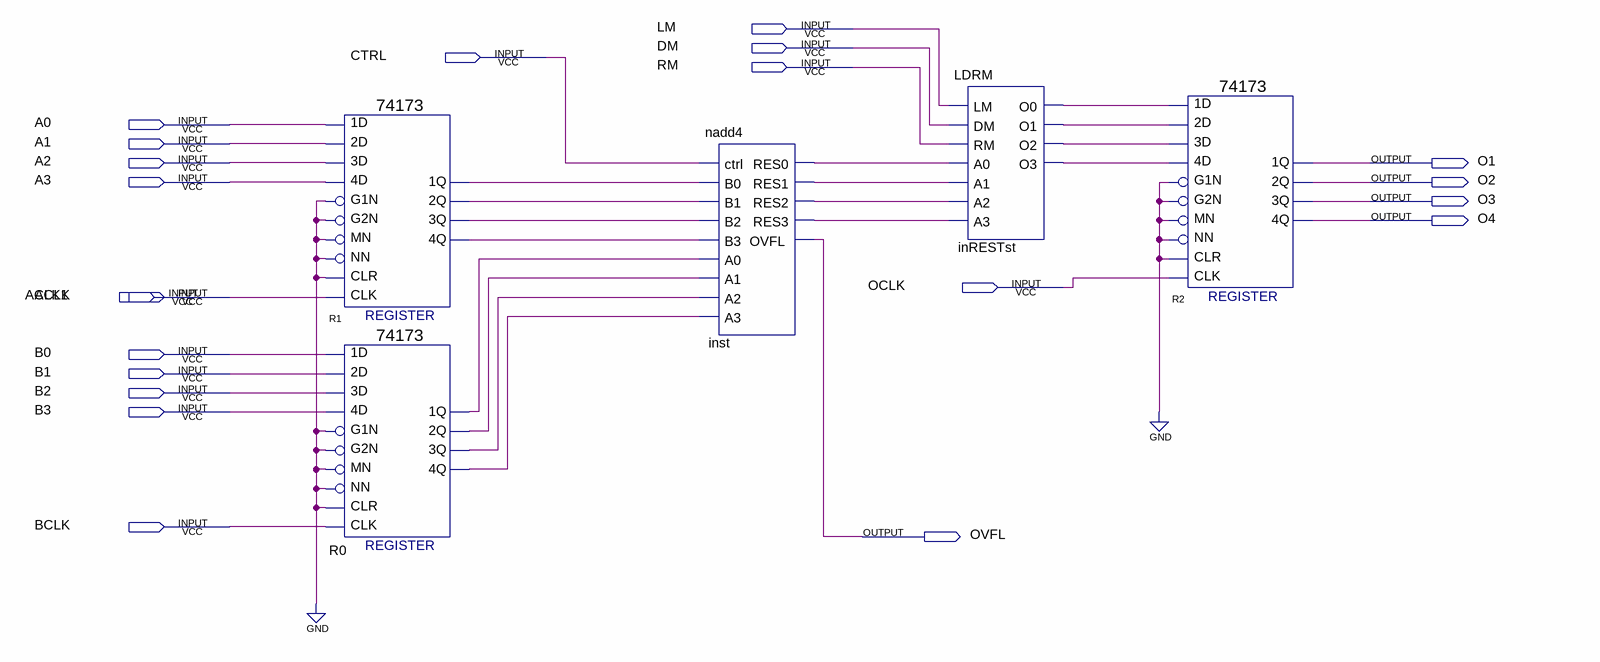
[diagram p0: schematic sheet]
// Quartus schematic exp5.bdf as structural Verilog: 5 symbols, 21 pins
module exp5 (
  input  LM,
  input  DM,
  input  CTRL,
  input  RM,
  input  A0,
  input  A1,
  input  A2,
  input  A3,
  input  OCLK,
  input  ACLK1,
  input  ACLK,
  input  B0,
  input  B1,
  input  B2,
  input  B3,
  input  BCLK,
  output O1,
  output O2,
  output O3,
  output O4,
  output OVFL
);

  wire inRESTst_o0, inRESTst_o1, inRESTst_o2, inRESTst_o3, inst_res0, inst_res1, inst_res2, inst_res3, R0_1q,
       R0_2q, R0_3q, R0_4q, R1_1q, R1_2q, R1_3q, R1_4q;

  \74173  R1 (
    .\3D (A2), .MN(1'b0), .\1D (A0), .\2D (A1), .\4D (A3), .G1N(1'b0), .G2N(1'b0), .NN(1'b0), .CLR(1'b0),
    .CLK(ACLK), .\3Q (R1_3q), .\2Q (R1_2q), .\1Q (R1_1q), .\4Q (R1_4q));
  \74173  R0 (
    .\3D (B2), .MN(1'b0), .\1D (B0), .\2D (B1), .\4D (B3), .G1N(1'b0), .G2N(1'b0), .NN(1'b0), .CLR(1'b0),
    .CLK(BCLK), .\3Q (R0_3q), .\2Q (R0_2q), .\1Q (R0_1q), .\4Q (R0_4q));
  nadd4 inst (
    .ctrl(CTRL), .B0(R1_1q), .B1(R1_2q), .B2(R1_3q), .B3(R1_4q), .A0(R0_1q), .A1(R0_2q), .A2(R0_3q),
    .A3(R0_4q), .RES0(inst_res0), .RES1(inst_res1), .RES2(inst_res2), .RES3(inst_res3), .OVFL(OVFL));
  LDRM inRESTst (
    .LM(LM), .DM(DM), .RM(RM), .A0(inst_res0), .A1(inst_res1), .A2(inst_res2), .A3(inst_res3),
    .O0(inRESTst_o0), .O1(inRESTst_o1), .O2(inRESTst_o2), .O3(inRESTst_o3));
  \74173  R2 (
    .\3D (inRESTst_o2), .MN(1'b0), .\1D (inRESTst_o0), .\2D (inRESTst_o1), .\4D (inRESTst_o3), .G1N(1'b0),
    .G2N(1'b0), .NN(1'b0), .CLR(1'b0), .CLK(OCLK), .\3Q (O3), .\2Q (O2), .\1Q (O1), .\4Q (O4));
endmodule
